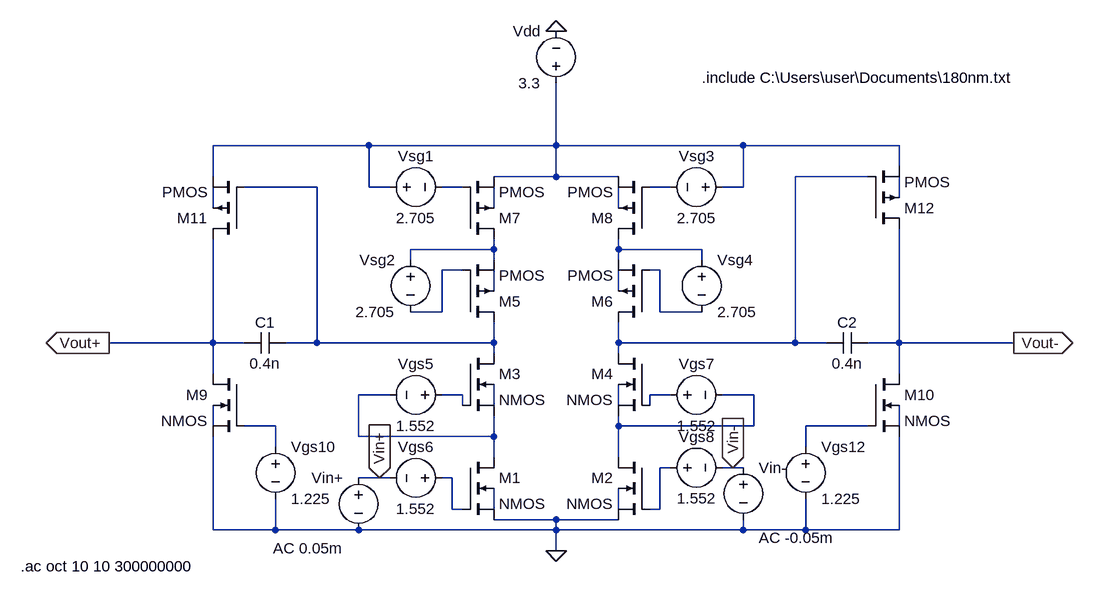
[diagram p0: schematic Draft3.asc]
Draft3.asc, the LTspice schematic file:
Version 4
SHEET 1 880 680
WIRE -384 -288 -624 -288
WIRE -96 -288 -96 -384
WIRE -96 -288 -384 -288
WIRE 192 -288 -96 -288
WIRE 432 -288 192 -288
WIRE 432 -256 432 -288
WIRE -624 -240 -624 -288
WIRE -96 -240 -96 -288
WIRE -96 -240 -192 -240
WIRE 0 -240 -96 -240
WIRE 384 -240 272 -240
WIRE -464 -224 -576 -224
WIRE -384 -224 -384 -288
WIRE -352 -224 -384 -224
WIRE -240 -224 -272 -224
WIRE 80 -224 48 -224
WIRE 192 -224 192 -288
WIRE 192 -224 160 -224
WIRE 432 -208 432 -240
WIRE -624 -192 -624 -224
WIRE -192 -192 -192 -224
WIRE 0 -192 0 -224
WIRE -192 -128 -192 -144
WIRE -192 -128 -320 -128
WIRE 0 -128 0 -144
WIRE 128 -128 0 -128
WIRE -320 -112 -320 -128
WIRE -192 -112 -192 -128
WIRE 0 -112 0 -128
WIRE 128 -112 128 -128
WIRE -240 -96 -272 -96
WIRE 64 -96 48 -96
WIRE -192 -64 -192 -96
WIRE 0 -64 0 -96
WIRE -272 -32 -272 -96
WIRE -272 -32 -320 -32
WIRE 64 -32 64 -96
WIRE 128 -32 64 -32
WIRE -624 16 -624 -144
WIRE -624 16 -784 16
WIRE -576 16 -624 16
WIRE -464 16 -464 -224
WIRE -464 16 -512 16
WIRE -192 16 -192 -16
WIRE -192 16 -464 16
WIRE 0 16 0 -16
WIRE 272 16 272 -240
WIRE 272 16 0 16
WIRE 320 16 272 16
WIRE 432 16 432 -160
WIRE 432 16 384 16
WIRE 608 16 432 16
WIRE -192 32 -192 16
WIRE 0 32 0 16
WIRE -624 64 -624 16
WIRE 432 64 432 16
WIRE -352 96 -400 96
WIRE -240 96 -272 96
WIRE 80 96 48 96
WIRE 208 96 160 96
WIRE -240 112 -240 96
WIRE -192 112 -192 80
WIRE 0 112 0 80
WIRE 48 112 48 96
WIRE -624 144 -624 112
WIRE -528 144 -576 144
WIRE 0 144 0 128
WIRE 208 144 208 96
WIRE 208 144 0 144
WIRE 384 144 288 144
WIRE 432 144 432 112
WIRE -400 160 -400 96
WIRE -192 160 -192 128
WIRE -192 160 -400 160
WIRE -528 176 -528 144
WIRE 288 176 288 144
WIRE -192 192 -192 160
WIRE 0 192 0 144
WIRE 80 208 64 208
WIRE 176 208 160 208
WIRE 192 208 176 208
WIRE -368 224 -400 224
WIRE -352 224 -368 224
WIRE -256 224 -272 224
WIRE -256 272 -256 224
WIRE -240 272 -256 272
WIRE -192 272 -192 240
WIRE 0 272 0 240
WIRE 64 272 64 208
WIRE 64 272 48 272
WIRE -96 288 -192 288
WIRE 0 288 -96 288
WIRE -624 304 -624 160
WIRE -528 304 -528 256
WIRE -528 304 -624 304
WIRE -400 304 -528 304
WIRE -96 304 -96 288
WIRE -96 304 -400 304
WIRE 192 304 192 288
WIRE 192 304 -96 304
WIRE 288 304 288 256
WIRE 288 304 192 304
WIRE 432 304 432 160
WIRE 432 304 288 304
WIRE -96 336 -96 304
FLAG -96 336 0
FLAG -96 -464 0
FLAG -784 16 Vout+
IOPIN -784 16 Out
FLAG 608 16 Vout-
IOPIN 608 16 Out
FLAG -368 224 Vin+
IOPIN -368 224 In
FLAG 176 208 Vin-
IOPIN 176 208 In
SYMBOL pmos4 -240 -144 M180
SYMATTR InstName M7
SYMATTR Value2 l=1.8u w=13u
SYMBOL pmos4 -240 -16 M180
SYMATTR InstName M5
SYMATTR Value2 l=0.18u w=1.0841u
SYMBOL pmos4 48 -144 R180
SYMATTR InstName M8
SYMATTR Value2 l=1.8u w=13u
SYMBOL pmos4 48 -16 R180
SYMATTR InstName M6
SYMATTR Value2 l=0.18u w=1.0841u
SYMBOL nmos4 -240 32 R0
SYMATTR InstName M3
SYMATTR Value2 l=1.8u w=30u
SYMBOL nmos4 -240 192 R0
SYMATTR InstName M1
SYMATTR Value2 l=72u w=311u
SYMBOL nmos4 48 32 M0
SYMATTR InstName M4
SYMATTR Value2 l=1.8u w=30u
SYMBOL nmos4 48 192 M0
SYMATTR InstName M2
SYMATTR Value2 l=72u w=311u
SYMBOL pmos4 -576 -144 R180
SYMATTR InstName M11
SYMATTR Value2 l=72u w=1540u
SYMBOL pmos4 384 -160 M180
SYMATTR InstName M12
SYMATTR Value2 l=72u w=1540u
SYMBOL nmos4 -576 64 M0
SYMATTR InstName M9
SYMATTR Value2 l=72u w=985u
SYMBOL nmos4 384 64 R0
SYMATTR InstName M10
SYMATTR Value2 l=72u w=985u
SYMBOL voltage -96 -368 R180
WINDOW 0 24 96 Left 2
WINDOW 3 24 16 Left 2
WINDOW 123 0 0 Left 2
WINDOW 39 0 0 Left 2
SYMATTR InstName Vdd
SYMATTR Value 3.3
SYMBOL cap -512 0 R90
WINDOW 0 0 32 VBottom 2
WINDOW 3 32 32 VTop 2
SYMATTR InstName C1
SYMATTR Value 0.4n
SYMBOL cap 384 0 R90
WINDOW 0 0 32 VBottom 2
WINDOW 3 32 32 VTop 2
SYMATTR InstName C2
SYMATTR Value 0.4n
SYMBOL voltage -528 160 R0
WINDOW 123 0 0 Left 2
WINDOW 39 0 0 Left 2
SYMATTR InstName Vgs10
SYMATTR Value 1.225
SYMBOL voltage 288 160 R0
WINDOW 123 0 0 Left 2
WINDOW 39 0 0 Left 2
SYMATTR InstName Vgs12
SYMATTR Value 1.225
SYMBOL voltage -368 -224 R270
WINDOW 0 32 56 VTop 2
WINDOW 3 -32 56 VBottom 2
WINDOW 123 0 0 Left 2
WINDOW 39 0 0 Left 2
SYMATTR InstName Vsg1
SYMATTR Value 2.705
SYMBOL voltage -320 -128 M0
WINDOW 123 0 0 Left 2
WINDOW 39 0 0 Left 2
SYMATTR InstName Vsg2
SYMATTR Value 2.705
SYMBOL voltage 128 -128 R0
WINDOW 123 0 0 Left 2
WINDOW 39 0 0 Left 2
SYMATTR InstName Vsg4
SYMATTR Value 2.705
SYMBOL voltage 176 -224 R90
WINDOW 0 -32 56 VBottom 2
WINDOW 3 32 56 VTop 2
WINDOW 123 0 0 Left 2
WINDOW 39 0 0 Left 2
SYMATTR InstName Vsg3
SYMATTR Value 2.705
SYMBOL voltage -256 96 R90
WINDOW 0 -32 56 VBottom 2
WINDOW 3 32 56 VTop 2
WINDOW 123 0 0 Left 2
WINDOW 39 0 0 Left 2
SYMATTR InstName Vgs5
SYMATTR Value 1.552
SYMBOL voltage -256 224 R90
WINDOW 0 -32 56 VBottom 2
WINDOW 3 32 56 VTop 2
WINDOW 123 0 0 Left 2
WINDOW 39 0 0 Left 2
SYMATTR InstName Vgs6
SYMATTR Value 1.552
SYMBOL voltage 64 96 R270
WINDOW 0 32 56 VTop 2
WINDOW 3 -32 56 VBottom 2
WINDOW 123 0 0 Left 2
WINDOW 39 0 0 Left 2
SYMATTR InstName Vgs7
SYMATTR Value 1.552
SYMBOL voltage 64 208 R270
WINDOW 0 32 56 VTop 2
WINDOW 3 -32 56 VBottom 2
WINDOW 123 0 0 Left 2
WINDOW 39 0 0 Left 2
SYMATTR InstName Vgs8
SYMATTR Value 1.552
SYMBOL voltage 192 192 R0
WINDOW 123 24 124 Left 2
WINDOW 39 0 0 Left 2
SYMATTR Value2 AC -0.05m
SYMATTR InstName Vin-
SYMATTR Value ""
SYMBOL voltage -400 208 M0
WINDOW 123 24 124 Left 2
WINDOW 39 0 0 Left 2
SYMATTR Value2 AC 0.05m
SYMATTR InstName Vin+
SYMATTR Value ""
TEXT 128 -392 Left 2 !.include C:\\Users\\user\\Documents\\180nm.txt
TEXT -920 360 Left 2 !.ac oct 10 10 300000000

The netlist it stands for:
* Draft3.asc
M7 N010 N004 N001 N008 PMOS l=1.8u w=13u
M5 N003 N012 N010 N014 PMOS l=0.18u w=1.0841u
M8 N011 N005 N001 N009 PMOS l=1.8u w=13u
M6 N002 N013 N011 N015 PMOS l=0.18u w=1.0841u
M3 N003 N017 N016 N020 NMOS l=1.8u w=30u
M1 N016 N027 0 N028 NMOS l=72u w=311u
M4 N002 N018 N019 N021 NMOS l=1.8u w=30u
M2 N019 N026 0 N029 NMOS l=72u w=311u
M11 Vout+ N003 N001 N007 PMOS l=72u w=1540u
M12 Vout- N002 N001 N006 PMOS l=72u w=1540u
M9 Vout+ N023 0 N022 NMOS l=72u w=985u
M10 Vout- N024 0 N025 NMOS l=72u w=985u
Vdd N001 0 3.3
C1 N003 Vout+ 0.4n
C2 Vout- N002 0.4n
Vgs10 N023 0 1.225
Vgs12 N024 0 1.225
Vsg1 N001 N004 2.705
Vsg2 N010 N012 2.705
Vsg4 N011 N013 2.705
Vsg3 N001 N005 2.705
Vgs5 N017 N016 1.552
Vgs6 N027 Vin+ 1.552
Vgs7 N018 N019 1.552
Vgs8 N026 Vin- 1.552
Vin- Vin- 0 AC -0.05m
Vin+ Vin+ 0 AC 0.05m
.model NMOS NMOS
.model PMOS PMOS
.lib standard.mos
.include C:\Users\user\Documents\180nm.txt
.ac oct 10 10 300000000
.backanno
.end